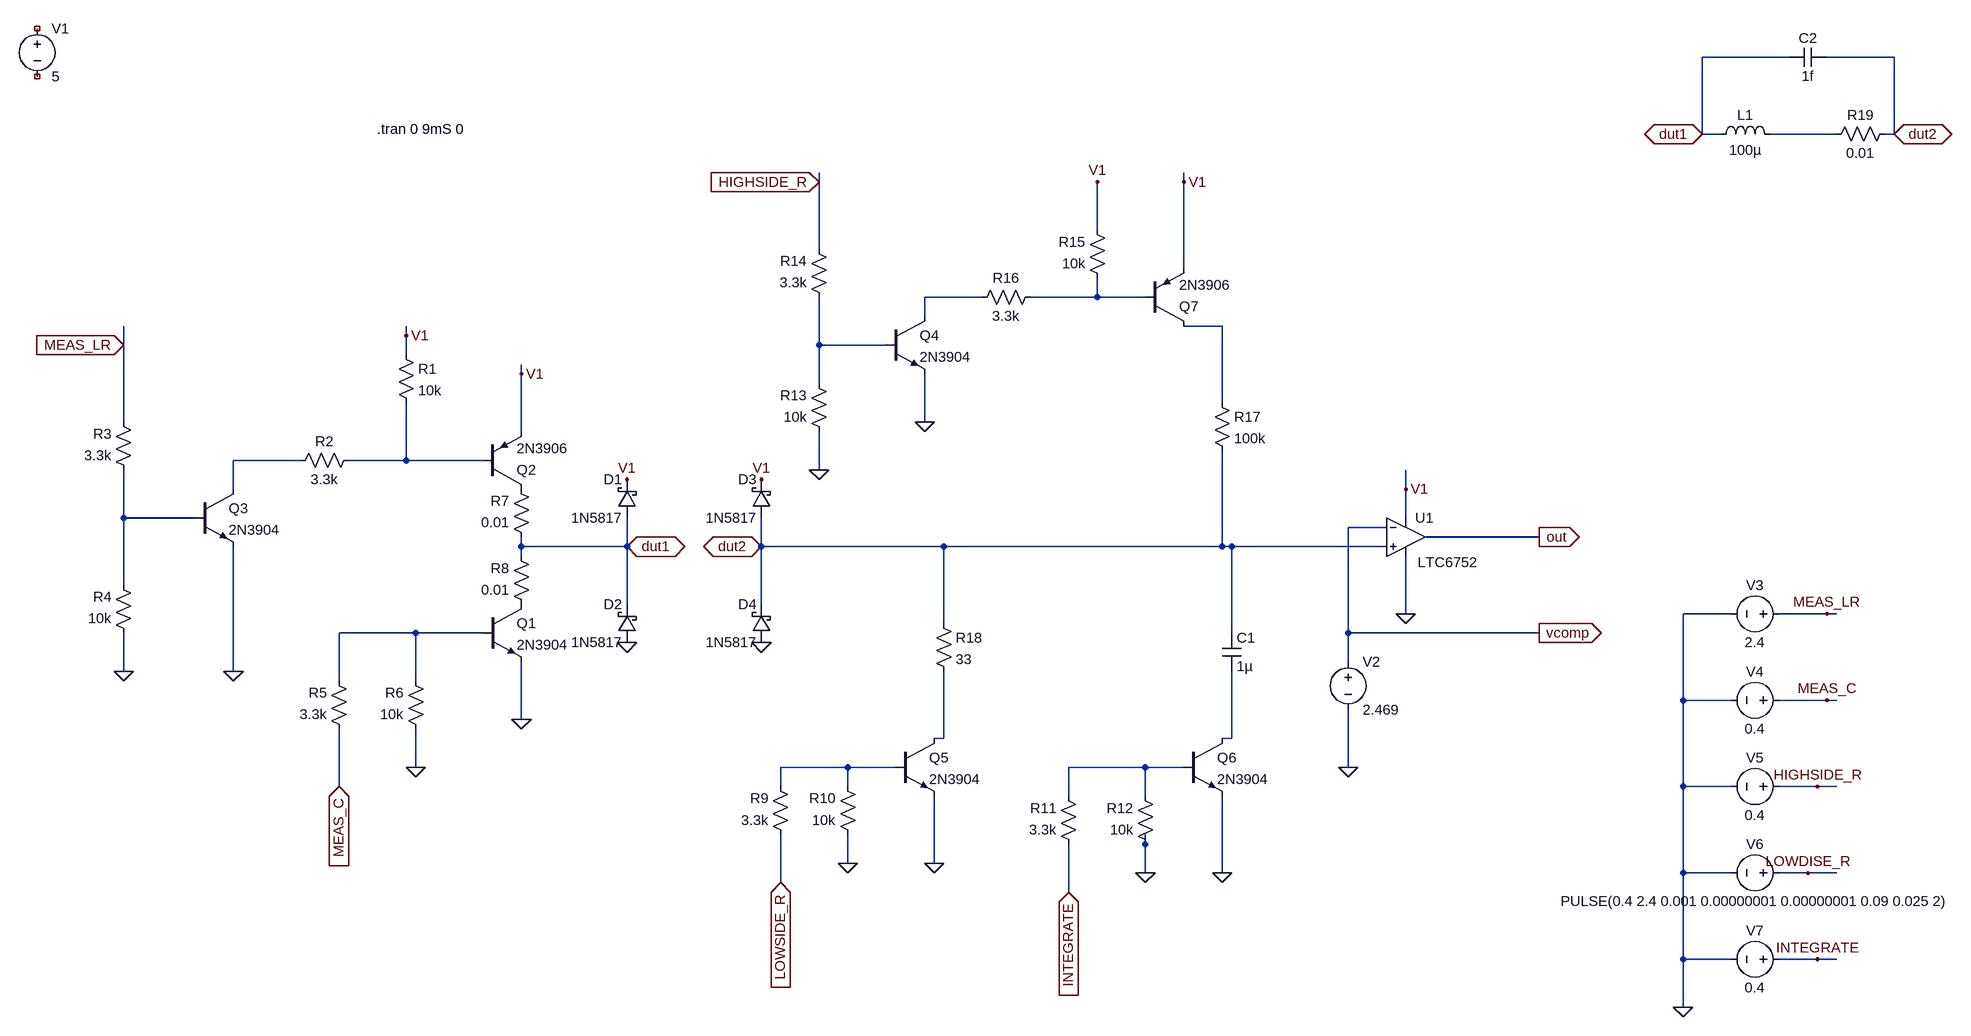
[diagram p0: schematic Draft1.asc]
Draft1.asc, the LTspice schematic file:
Version 4
SHEET 1 2880 816
WIRE 2592 -784 2448 -784
WIRE 2768 -784 2656 -784
WIRE 2448 -656 2448 -784
WIRE 2480 -656 2448 -656
WIRE 2672 -656 2560 -656
WIRE 2768 -656 2768 -784
WIRE 2768 -656 2752 -656
WIRE 816 -576 816 -592
WIRE 1424 -576 1424 -592
WIRE 1280 -496 1280 -576
WIRE 816 -464 816 -576
WIRE 1424 -432 1424 -576
WIRE 1088 -384 992 -384
WIRE 1280 -384 1280 -416
WIRE 1280 -384 1168 -384
WIRE 1360 -384 1280 -384
WIRE 992 -352 992 -384
WIRE 1488 -336 1424 -336
WIRE 128 -320 128 -336
WIRE -368 -304 -368 -336
WIRE 816 -304 816 -384
WIRE 928 -304 816 -304
WIRE 128 -288 128 -320
WIRE 320 -256 320 -272
WIRE 816 -240 816 -304
WIRE 1488 -208 1488 -336
WIRE -368 -176 -368 -304
WIRE 992 -176 992 -256
WIRE 320 -160 320 -256
WIRE -48 -112 -160 -112
WIRE 128 -112 128 -208
WIRE 128 -112 32 -112
WIRE 256 -112 128 -112
WIRE 816 -96 816 -160
WIRE -160 -64 -160 -112
WIRE 1904 -64 1904 -96
WIRE -368 -16 -368 -96
WIRE -224 -16 -368 -16
WIRE 1904 -16 1904 -64
WIRE 1872 0 1808 0
WIRE 2176 16 1936 16
WIRE 320 32 320 16
WIRE 496 32 496 -16
WIRE 496 32 320 32
WIRE 720 32 720 -16
WIRE 1024 32 720 32
WIRE 1488 32 1488 -128
WIRE 1488 32 1024 32
WIRE 1504 32 1488 32
WIRE 1872 32 1504 32
WIRE 320 48 320 32
WIRE -368 96 -368 -16
WIRE 496 128 496 32
WIRE 720 128 720 32
WIRE 1904 144 1904 48
WIRE 2496 144 2416 144
WIRE 2656 144 2576 144
WIRE 2672 144 2656 144
WIRE 1024 160 1024 32
WIRE 144 176 16 176
WIRE 256 176 144 176
WIRE 1504 176 1504 32
WIRE 1808 176 1808 0
WIRE 2176 176 1808 176
WIRE 1808 224 1808 176
WIRE -368 240 -368 176
WIRE -160 240 -160 32
WIRE 16 256 16 176
WIRE 144 256 144 176
WIRE 2416 288 2416 144
WIRE 2496 288 2416 288
WIRE 2656 288 2576 288
WIRE 2672 288 2656 288
WIRE 320 320 320 224
WIRE 1024 352 1024 240
WIRE 1024 352 1008 352
WIRE 1504 352 1504 240
WIRE 1504 352 1488 352
WIRE 144 400 144 336
WIRE 864 400 752 400
WIRE 944 400 864 400
WIRE 1360 400 1232 400
WIRE 1424 400 1360 400
WIRE 1808 400 1808 304
WIRE 16 432 16 336
WIRE 752 432 752 400
WIRE 864 432 864 400
WIRE 2416 432 2416 288
WIRE 2496 432 2416 432
WIRE 2640 432 2576 432
WIRE 2672 432 2640 432
WIRE 1232 448 1232 400
WIRE 1360 448 1360 400
WIRE 1360 528 1360 512
WIRE 864 560 864 512
WIRE 1008 560 1008 448
WIRE 1360 576 1360 528
WIRE 1488 576 1488 448
WIRE 2416 576 2416 432
WIRE 2496 576 2416 576
WIRE 2624 576 2576 576
WIRE 2672 576 2624 576
WIRE 752 592 752 512
WIRE 1232 608 1232 528
WIRE 2416 720 2416 576
WIRE 2496 720 2416 720
WIRE 2640 720 2576 720
WIRE 2672 720 2640 720
WIRE 2416 800 2416 720
FLAG 320 320 0
FLAG 144 400 0
FLAG 864 560 0
FLAG 1008 560 0
FLAG 1360 576 0
FLAG 1488 576 0
FLAG 992 -176 0
FLAG -368 240 0
FLAG -160 240 0
FLAG 816 -96 0
FLAG 128 -320 V1
FLAG 320 -256 V1
FLAG 496 192 0
FLAG 720 192 0
FLAG 496 -80 V1
FLAG 720 -80 V1
FLAG 1280 -576 V1
FLAG 1424 -576 V1
FLAG 1808 400 0
FLAG 1904 144 0
FLAG 1904 -64 V1
FLAG 2656 144 MEAS_LR
FLAG 2656 288 MEAS_C
FLAG 2640 432 HIGHSIDE_R
FLAG 2624 576 LOWDISE_R
FLAG 2640 720 INTEGRATE
FLAG 2416 800 0
FLAG 496 32 dut1
IOPIN 496 32 BiDir
FLAG 720 32 dut2
IOPIN 720 32 BiDir
FLAG 2448 -656 dut1
IOPIN 2448 -656 BiDir
FLAG 2768 -656 dut2
IOPIN 2768 -656 BiDir
FLAG 2176 16 out
IOPIN 2176 16 Out
FLAG 2176 176 vcomp
IOPIN 2176 176 Out
FLAG -368 -304 MEAS_LR
IOPIN -368 -304 In
FLAG 752 592 LOWSIDE_R
IOPIN 752 592 In
FLAG 1232 608 INTEGRATE
IOPIN 1232 608 In
FLAG 816 -576 HIGHSIDE_R
IOPIN 816 -576 In
FLAG 16 432 MEAS_C
IOPIN 16 432 In
DATAFLAG -368 -304 "$"
DATAFLAG -368 -304 "$"
SYMBOL npn 256 128 R0
SYMATTR InstName Q1
SYMATTR Value 2N3904
SYMBOL pnp 256 -64 M180
SYMATTR InstName Q2
SYMATTR Value 2N3906
SYMBOL npn -224 -64 R0
SYMATTR InstName Q3
SYMATTR Value 2N3904
SYMBOL npn 928 -352 R0
SYMATTR InstName Q4
SYMATTR Value 2N3904
SYMBOL npn 944 352 R0
SYMATTR InstName Q5
SYMATTR Value 2N3904
SYMBOL npn 1424 352 R0
SYMATTR InstName Q6
SYMATTR Value 2N3904
SYMBOL pnp 1360 -336 M180
SYMATTR InstName Q7
SYMATTR Value 2N3906
SYMBOL res 112 -304 R0
SYMATTR InstName R1
SYMATTR Value 10k
SYMBOL res 48 -128 R90
WINDOW 0 0 56 VBottom 2
WINDOW 3 32 56 VTop 2
SYMATTR InstName R2
SYMATTR Value 3.3k
SYMBOL res -352 -80 R180
WINDOW 0 36 76 Left 2
WINDOW 3 36 40 Left 2
SYMATTR InstName R3
SYMATTR Value 3.3k
SYMBOL res -352 192 R180
WINDOW 0 36 76 Left 2
WINDOW 3 36 40 Left 2
SYMATTR InstName R4
SYMATTR Value 10k
SYMBOL res 32 352 R180
WINDOW 0 36 76 Left 2
WINDOW 3 36 40 Left 2
SYMATTR InstName R5
SYMATTR Value 3.3k
SYMBOL res 160 352 R180
WINDOW 0 36 76 Left 2
WINDOW 3 36 40 Left 2
SYMATTR InstName R6
SYMATTR Value 10k
SYMBOL res 336 32 R180
WINDOW 0 36 76 Left 2
WINDOW 3 36 40 Left 2
SYMATTR InstName R7
SYMATTR Value 0.01
SYMBOL res 336 144 R180
WINDOW 0 36 76 Left 2
WINDOW 3 36 40 Left 2
SYMATTR InstName R8
SYMATTR Value 0.01
SYMBOL res 768 528 R180
WINDOW 0 36 76 Left 2
WINDOW 3 36 40 Left 2
SYMATTR InstName R9
SYMATTR Value 3.3k
SYMBOL res 880 528 R180
WINDOW 0 36 76 Left 2
WINDOW 3 36 40 Left 2
SYMATTR InstName R10
SYMATTR Value 10k
SYMBOL res 1248 544 R180
WINDOW 0 36 76 Left 2
WINDOW 3 36 40 Left 2
SYMATTR InstName R11
SYMATTR Value 3.3k
SYMBOL res 1376 544 R180
WINDOW 0 36 76 Left 2
WINDOW 3 36 40 Left 2
SYMATTR InstName R12
SYMATTR Value 10k
SYMBOL res 832 -144 R180
WINDOW 0 36 76 Left 2
WINDOW 3 36 40 Left 2
SYMATTR InstName R13
SYMATTR Value 10k
SYMBOL res 832 -368 R180
WINDOW 0 36 76 Left 2
WINDOW 3 36 40 Left 2
SYMATTR InstName R14
SYMATTR Value 3.3k
SYMBOL res 1296 -400 R180
WINDOW 0 36 76 Left 2
WINDOW 3 36 40 Left 2
SYMATTR InstName R15
SYMATTR Value 10k
SYMBOL res 1072 -368 R270
WINDOW 0 32 56 VTop 2
WINDOW 3 0 56 VBottom 2
SYMATTR InstName R16
SYMATTR Value 3.3k
SYMBOL res 1472 -224 R0
SYMATTR InstName R17
SYMATTR Value 100k
SYMBOL cap 1488 176 R0
SYMATTR InstName C1
SYMATTR Value 1µ
SYMBOL res 1008 144 R0
SYMATTR InstName R18
SYMATTR Value 33
SYMBOL Comparators/LTC6752 1904 -48 R0
WINDOW 3 20 106 Left 2
SYMATTR InstName U1
SYMBOL voltage -512 -848 R0
SYMATTR InstName V1
SYMATTR Value 5
SYMBOL voltage 1808 208 R0
SYMATTR InstName V2
SYMATTR Value 2.469
SYMBOL schottky 512 -16 R180
WINDOW 0 24 64 Left 2
WINDOW 3 24 0 Left 2
SYMATTR InstName D1
SYMATTR Value 1N5817
SYMATTR Description Zener Diode
SYMATTR Type zener
SYMBOL schottky 512 192 R180
WINDOW 0 24 64 Left 2
WINDOW 3 24 0 Left 2
SYMATTR InstName D2
SYMATTR Value 1N5817
SYMATTR Description Zener Diode
SYMATTR Type zener
SYMBOL schottky 736 -16 R180
WINDOW 0 24 64 Left 2
WINDOW 3 24 0 Left 2
SYMATTR InstName D3
SYMATTR Value 1N5817
SYMATTR Description Zener Diode
SYMATTR Type zener
SYMBOL schottky 736 192 R180
WINDOW 0 24 64 Left 2
WINDOW 3 24 0 Left 2
SYMATTR InstName D4
SYMATTR Value 1N5817
SYMATTR Description Zener Diode
SYMATTR Type zener
SYMBOL voltage 2592 144 R90
WINDOW 0 -32 56 VBottom 2
WINDOW 3 32 56 VTop 2
SYMATTR InstName V3
SYMATTR Value 2.4
SYMBOL voltage 2592 288 R90
WINDOW 0 -32 56 VBottom 2
WINDOW 3 32 56 VTop 2
SYMATTR InstName V4
SYMATTR Value 0.4
SYMBOL voltage 2592 432 R90
WINDOW 0 -32 56 VBottom 2
WINDOW 3 32 56 VTop 2
SYMATTR InstName V5
SYMATTR Value 0.4
SYMBOL voltage 2592 576 R90
WINDOW 0 -32 56 VBottom 2
WINDOW 3 32 56 VTop 2
SYMATTR InstName V6
SYMATTR Value PULSE(0.4 2.4 0.001 0.00000001 0.00000001 0.09 0.025 2)
SYMBOL voltage 2592 720 R90
WINDOW 0 -32 56 VBottom 2
WINDOW 3 32 56 VTop 2
SYMATTR InstName V7
SYMATTR Value 0.4
SYMBOL ind 2464 -640 R270
WINDOW 0 32 56 VTop 2
WINDOW 3 5 56 VBottom 2
SYMATTR InstName L1
SYMATTR Value 100µ
SYMBOL res 2768 -672 R90
WINDOW 0 0 56 VBottom 2
WINDOW 3 32 56 VTop 2
SYMATTR InstName R19
SYMATTR Value 0.01
SYMBOL cap 2656 -800 R90
WINDOW 0 0 32 VBottom 2
WINDOW 3 32 32 VTop 2
SYMATTR InstName C2
SYMATTR Value 1f
TEXT 80 -664 Left 2 !.tran 0 9mS 0

The netlist it stands for:
* Draft1.asc
Q1 P001 N009 0 0 2N3904
Q2 P002 N007 V1 0 2N3906
Q3 N006 N008 0 0 2N3904
Q4 N002 N005 0 0 2N3904
Q5 N010 N012 0 0 2N3904
Q6 N011 N013 0 0 2N3904
Q7 N004 N003 V1 0 2N3906
R1 V1 N007 10k
R2 N007 N006 3.3k
R3 N008 MEAS_LR 3.3k
R4 0 N008 10k
R5 MEAS_C N009 3.3k
R6 0 N009 10k
R7 dut1 P002 0.01
R8 P001 dut1 0.01
R9 LOWSIDE_R N012 3.3k
R10 0 N012 10k
R11 INTEGRATE N013 3.3k
R12 0 N013 10k
R13 0 N005 10k
R14 N005 HIGHSIDE_R 3.3k
R15 N003 V1 10k
R16 N002 N003 3.3k
R17 N004 dut2 100k
C1 dut2 N011 1µ
R18 dut2 N010 33
XU1 dut2 vcomp V1 0 out LTC6752  ; pins In+ In- V+ V- OUT
V1 NC_01 NC_02 5
V2 vcomp 0 2.469
D1 dut1 V1 1N5817
D2 0 dut1 1N5817
D3 dut2 V1 1N5817
D4 0 dut2 1N5817
V3 MEAS_LR 0 2.4
V4 MEAS_C 0 0.4
V5 HIGHSIDE_R 0 0.4
V6 LOWDISE_R 0 PULSE(0.4 2.4 0.001 0.00000001 0.00000001 0.09 0.025 2)
V7 INTEGRATE 0 0.4
L1 dut1 N001 100µ
R19 dut2 N001 0.01
C2 dut2 dut1 1f
.model D D
.lib standard.dio
.model NPN NPN
.model PNP PNP
.lib standard.bjt
.tran 0 9mS 0
.lib LTC7.lib
.backanno
.end